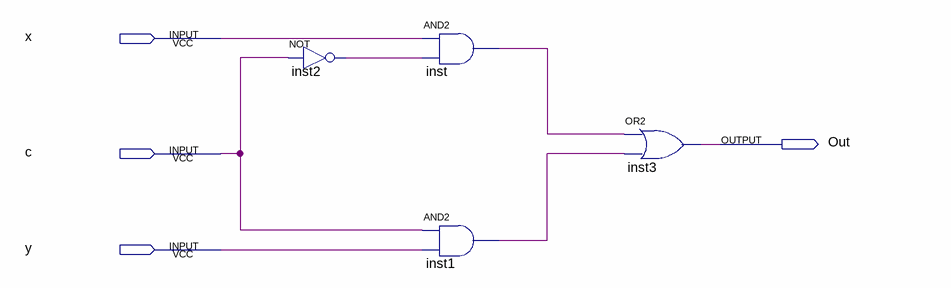
[diagram p0: schematic sheet]
// Quartus schematic MUX_2x1.bdf as structural Verilog: 4 symbols, 4 pins
module MUX_2x1 (
  input  x,
  input  c,
  input  y,
  output Out
);

  wire inst1_out, inst2_out, inst_out;

  not inst2 (inst2_out, c);
  and inst (inst_out, x, inst2_out);
  and inst1 (inst1_out, c, y);
  or inst3 (Out, inst_out, inst1_out);
endmodule
